# Altium project Break Board_Rev02.PrjPcb
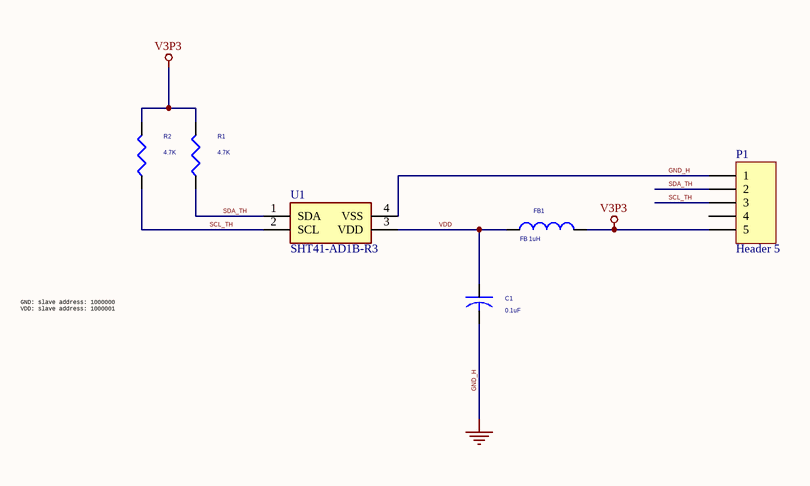
[diagram p0: Break Board_Rev02.SchDoc]
1 sheet, 6 parts. Net scope: global (net labels, ports and power ports of the same name join across sheets).
Board file: Break Board_Rev02.PcbDoc

## Sheet Break Board_Rev02.SchDoc
size A

### Parts
C1  0.1uF  [0603 Capacitor]
FB1  FB 1uH  [FD_0603(1608)_W]
P1  Header 5  [HDR1X5]
R1  4.7K  [R_0603_W]
R2  4.7K  [R_0603_W]
U1  SHT41-AD1B-R3  [SHT41AD1BR3]

### Nets
GND_H: C1.2 P1.1 U1.4(VSS)  [also labelled GND_POWER]
V3P3: FB1.2 P1.5 R1.2 R2.2
SCL_TH: P1.3 R2.1 U1.2(SCL)
SDA_TH: P1.2 R1.1 U1.1(SDA)
VDD: C1.1 FB1.1 U1.3(VDD)

Not connected (* = marked no-connect by the designer): P1 4

### Notes on the sheet
- GND: slave address: 1000000
  VDD: slave address: 1000001

### Library data of the parts
C1 = CAP: Part Number: 1276-1011-2-ND
FB1 = INDUCTOR: FILTER CHIP 120 OHM 3A 0603; Part Number: 490-3996-1-ND; Manufacturer Part Number: MMZ2012Y152B; Type: Ferrite; Package: 0603; Distributor Part Number: MMZ2012Y152B
P1 = Header 5: Header, 5-Pin; LatestRevisionDate: 17-Jul-2002; LatestRevisionNote: Re-released for DXP Platform.; Publisher: Altium Limited
R1 R2 = R: Part Number: P4.7KDBTR-ND; Package: 0603; Type: Resistor
U1 = SHT41-AD1B-R3: Integrated Circuit; Manufacturer_Name: Sensirion; Datasheet Link: https://www.mouser.fr/datasheet/2/682/Sensirion_Humidity_Sensors_SHT4x_Datasheet-2001050.pdf; Height: 0.59mm; Manufacturer_Part_Number: SHT41-AD1B-R3; Mouser Part Number: 403-SHT41-AD1B-R3; Mouser Price/Stock: https://www.mouser.co.uk/ProductDetail/Sensirion/SHT41-AD1B-R3?qs=XAiT9M5g4x9TCtE5W6N3dA%3D%3D; Arrow Part Number: SHT41-AD1B-R3; Arrow Price/Stock: https://www.arrow.com/en/products/sht41-ad1b-r3/sensirion-ag?region=nac